# EAGLE design Ing_DC2013 (EAGLE 6.4)
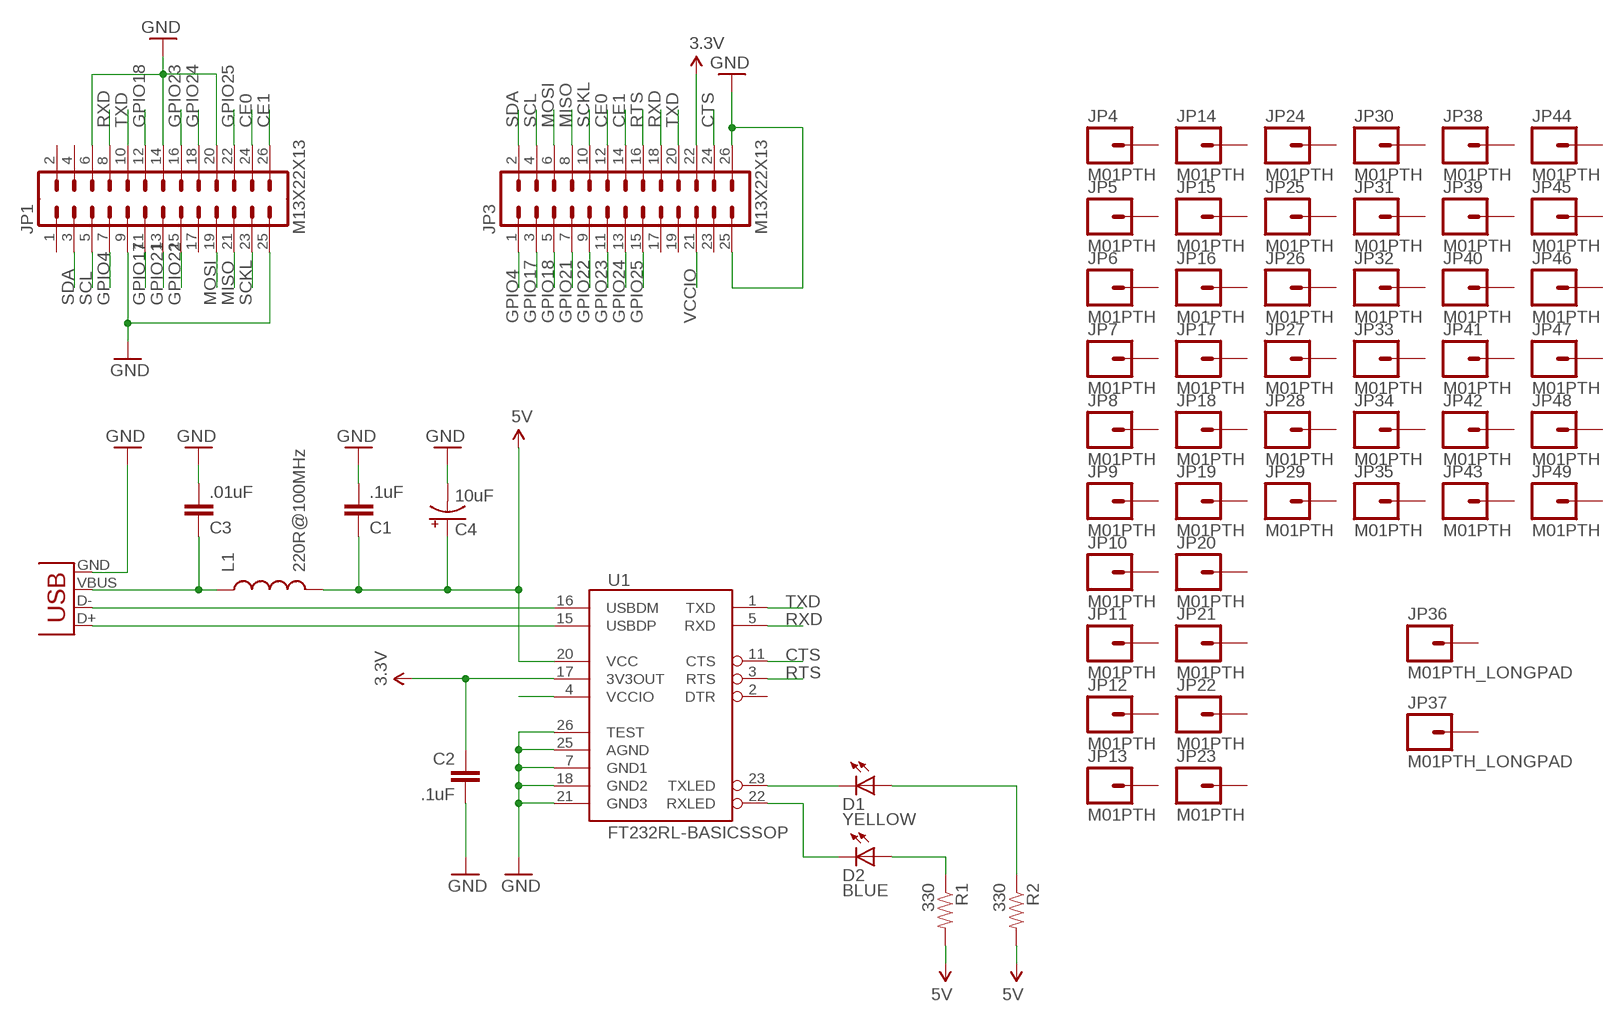
[diagram p0: schematic, sheet 1]

## Parts
C1  .1uF  CAP1206  [1206]
C2  .1uF  CAP1206  [1206]
C3  .01uF  CAP1206  [1206]
C4  10uF  CAP_POL1206  [EIA3216]
D1  YELLOW  LED-RED1206  [LED-1206]
D2  BLUE  LED-GREENLARGE  [LED-1206]
JP1  M13X22X13  [2X13]
JP2  USB-SMD-NS  [USB-MINIB-NOSTOP]
JP3  M13X22X13  [2X13]
JP4  M01PTH  [1X01]
JP5  M01PTH  [1X01]
JP6  M01PTH  [1X01]
JP7  M01PTH  [1X01]
JP8  M01PTH  [1X01]
JP9  M01PTH  [1X01]
JP10  M01PTH  [1X01]
JP11  M01PTH  [1X01]
JP12  M01PTH  [1X01]
JP13  M01PTH  [1X01]
JP14  M01PTH  [1X01]
JP15  M01PTH  [1X01]
JP16  M01PTH  [1X01]
JP17  M01PTH  [1X01]
JP18  M01PTH  [1X01]
JP19  M01PTH  [1X01]
JP20  M01PTH  [1X01]
JP21  M01PTH  [1X01]
JP22  M01PTH  [1X01]
JP23  M01PTH  [1X01]
JP24  M01PTH  [1X01]
JP25  M01PTH  [1X01]
JP26  M01PTH  [1X01]
JP27  M01PTH  [1X01]
JP28  M01PTH  [1X01]
JP29  M01PTH  [1X01]
JP30  M01PTH  [1X01]
JP31  M01PTH  [1X01]
JP32  M01PTH  [1X01]
JP33  M01PTH  [1X01]
JP34  M01PTH  [1X01]
JP35  M01PTH  [1X01]
JP36  M01PTH_LONGPAD  [1X01_LONGPAD]
JP37  M01PTH_LONGPAD  [1X01_LONGPAD]
JP38  M01PTH  [1X01]
JP39  M01PTH  [1X01]
JP40  M01PTH  [1X01]
JP41  M01PTH  [1X01]
JP42  M01PTH  [1X01]
JP43  M01PTH  [1X01]
JP44  M01PTH  [1X01]
JP45  M01PTH  [1X01]
JP46  M01PTH  [1X01]
JP47  M01PTH  [1X01]
JP48  M01PTH  [1X01]
JP49  M01PTH  [1X01]
L1  220R@100MHz  INDUCTOR1210  [1210]
R1  330  RESISTOR1206  [1206]
R2  330  RESISTOR1206  [1206]
U1  FT232RL-BASICSSOP  [SSOP28DB]

## Nets
3.3V: C2.1 JP3.22 U1.17(3V3OUT)
5V: C1.1 C4.A(+) L1.2 R1.2 R2.2 U1.20(VCC)
CE0: JP1.24 JP3.12
CE1: JP1.26 JP3.14
CTS: JP3.24 U1.11(CTS)
GND: C1.2 C2.2 C3.2 C4.C(-) JP1.6 JP1.9 JP1.14 JP1.20 JP1.25 JP2.GND JP3.25 JP3.26 U1.7(GND1) U1.18(GND2) U1.21(GND3) U1.25(AGND) U1.26(TEST)
GPIO4: JP1.7 JP3.1
GPIO17: JP1.11 JP3.3
GPIO18: JP1.12 JP3.5
GPIO21: JP1.13 JP3.7
GPIO22: JP1.15 JP3.9
GPIO23: JP1.16 JP3.11
GPIO24: JP1.18 JP3.13
GPIO25: JP1.22 JP3.15
MISO: JP1.21 JP3.8
MOSI: JP1.19 JP3.6
N$1: C3.1 JP2.VBUS L1.1
N$2: D2.A R1.1
N$3: D2.C U1.22(RXLED)
N$4: D1.C U1.23(TXLED)
N$5: JP2.D- U1.16(USBDM)
N$6: JP2.D+ U1.15(USBDP)
N$7: D1.A R2.1
RTS: JP3.16 U1.3(RTS)
RXD: JP1.8 JP3.18 U1.5(RXD)
SCKL: JP1.23 JP3.10
SCL: JP1.5 JP3.4
SDA: JP1.3 JP3.2
TXD: JP1.10 JP3.20 U1.1(TXD)
VCCIO: JP3.21 U1.4(VCCIO)
Unconnected: JP1.1 JP1.2 JP1.4 JP1.17 JP3.17 JP3.19 JP3.23 JP4.1 JP5.1 JP6.1 JP7.1 JP8.1 JP9.1 JP10.1 JP11.1 JP12.1 JP13.1 JP14.1 JP15.1 JP16.1 JP17.1 JP18.1 JP19.1 JP20.1 JP21.1 JP22.1 JP23.1 JP24.1 JP25.1 JP26.1 JP27.1 JP28.1 JP29.1 JP30.1 JP31.1 JP32.1 JP33.1 JP34.1 JP35.1 JP36.1 JP37.1 JP38.1 JP39.1 JP40.1 JP41.1 JP42.1 JP43.1 JP44.1 JP45.1 JP46.1 JP47.1 JP48.1 JP49.1 U1.2(DTR)

## Library data of the parts
C1-C3 = SparkFun-Capacitors:CAP: Capacitor Standard 0603 ceramic capacitor, and 0.1" leaded capacitor.
C4 = SparkFun-Capacitors:CAP_POL: Capacitor Polarized These are standard SMD and PTH capacitors. Normally 10uF, 47uF, and 100uF in electrolytic and tantalum varieties. Always verify the external diameter of the through hole cap, it varies with capacity, voltage, and manufacturer. The EIA devices should be standard.
D1 = SparkFun-LED:LED-RED: Assorted Red LEDs LilyPad 1206- DIO-09912 1206- DIO-00809 0603- DIO-00819; PROD_ID: DIO-00809; VALUE: RED
D2 = SparkFun-LED:LED-GREEN: Various green LEDs 0603- DIO-00821 LARGE- DIO-00862 LILYPAD- DIO-09910; PROD_ID: DIO-00862; VALUE: GREEN
JP1 JP3 = SparkFun-Connectors:M13X2: 0.1" spaced headers
JP2 = SparkFun-Connectors:USB: USB Connectors USB-B-PTH is fully proven SKU : PRT-00139/CONN-08278 USB-miniB is fully proven SKU : PRT-00587 USB-A-PCB is untested. USB-A-H is throughly reviewed, but untested. Spark Fun Electronics SKU : PRT-00437 USB-B-SMT is throughly reviewed, but untested. Needs silkscreen touching up. USB-A-S has not been used/tested USB-MB-H has not been used/tested USB-MICROB has been used. CONN-09505
JP4-JP49 = SparkFun-Connectors:M01: Header 1 Standard 1-pin 0.1" header. Use with straight break away headers (SKU : PRT-00116), right angle break away headers (PRT-00553), swiss pins (PRT-00743), machine pins (PRT-00117), and female headers (PRT-00115).
L1 = SparkFun-Passives:INDUCTOR: Inductors Basic Inductor/Choke - 0603 and 1206. Footprints are not proven and vary greatly between part numbers.
R1 R2 = SparkFun-Resistors:RESISTOR: Resistor Basic schematic elements and footprints for 0603, 1206, and PTH resistors.
U1 = SparkFun-DigitalIC:FT232RL-BASIC: USB UART This is the simplified version of the FT232RL unit. Only what you need, nothing you don't. Spark Fun Electronics SKU : COM-00650

## Net classes
0 default: width 0.305 mm, drill 0.508 mm, clearance 0.254 mm

## Board
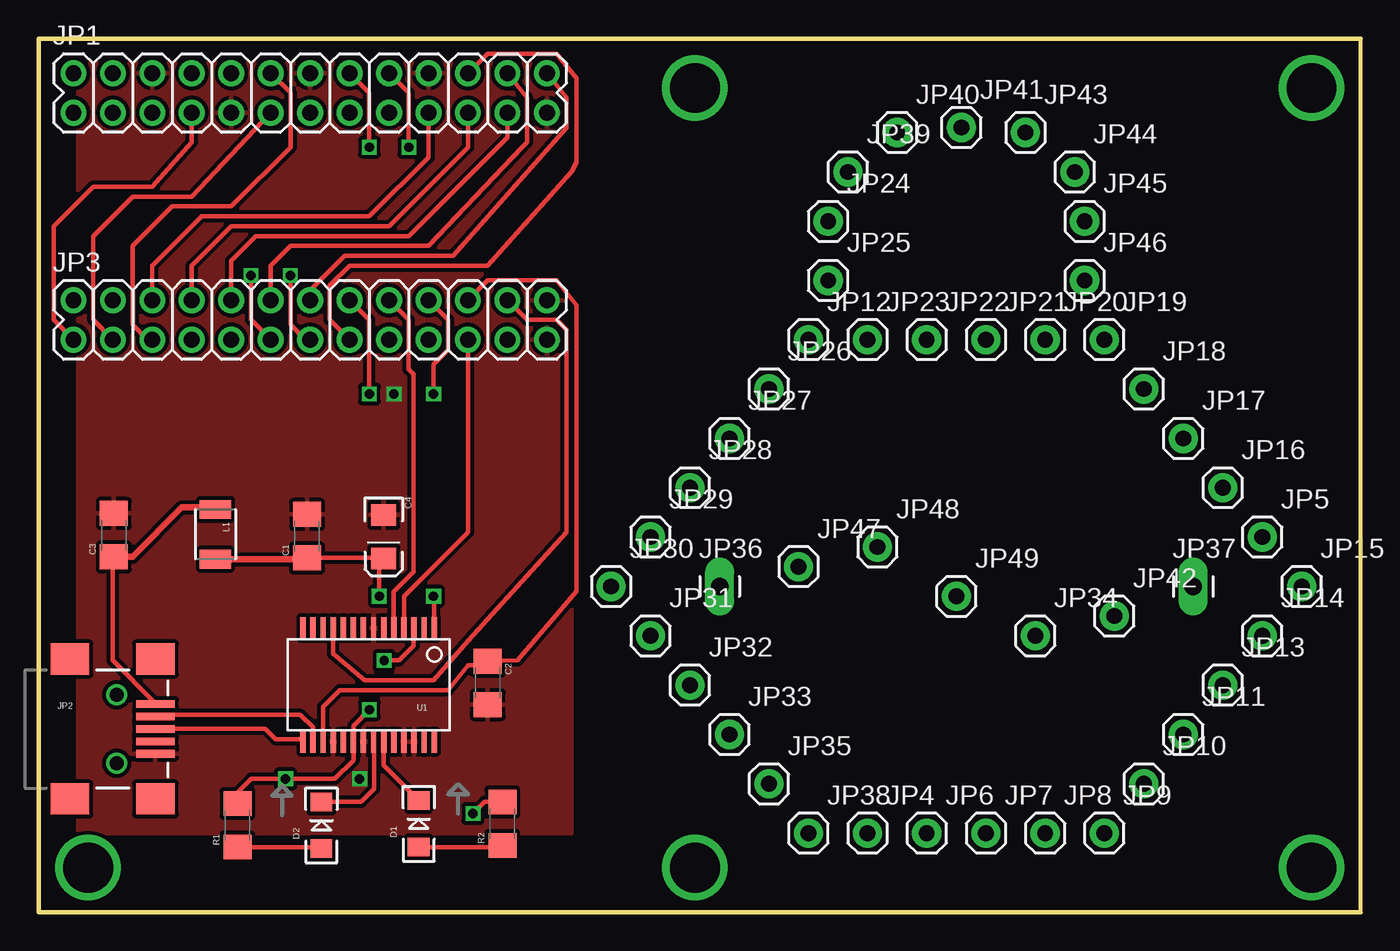
[diagram p1: board, top side]
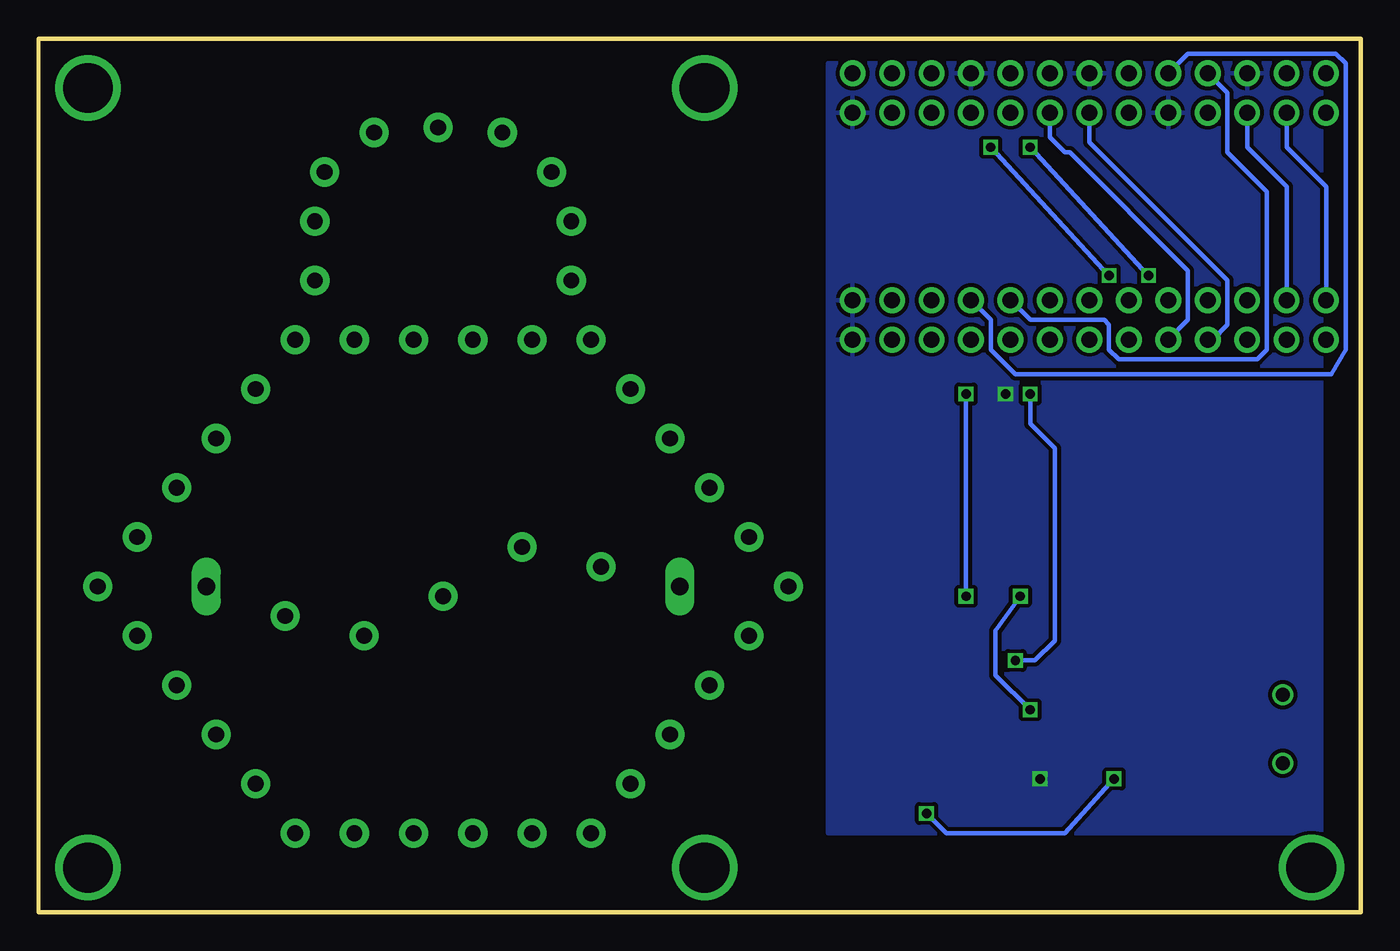
[diagram p2: board, bottom side, seen from below]

Size 85.08 x 56.19 mm. Coordinates in mm from the lower left corner, seen from the top.
Outline: 0,0 85.08,0 85.08,56.19 0,56.19 0,0
Copper layers (1*16): Top 0.0356mm / dielectric 1.5011mm / Bottom 0.0356mm
Design rules "LaenPCBOrder": minimum track width 6mil, minimum drill 13mil, track to track 6mil, track to pad 6mil, pad to pad 6mil, via to via 6mil, smd to smd 6mil, copper to edge 15mil, drill to drill 6mil, minimum pad ring 7mil, minimum via ring 7mil, stop-mask expansion 4mil, vias tented up to drill 0mil, thermal gap 10mil

### Footprints (pad centres in the part's own frame; a part is rotated, then mirrored left to right if it is on the bottom)
1206 = smd 1.6 x 1.8: 1 -1.4,0; 2 1.4,0
EIA3216 = smd 1.4 x 1.6: A 1.4,0; C -1.4,0
LED-1206 = smd 1.2 x 1.4: A -1.5,0; C 1.5,0
2X13 = drill 1.016 pad 1.651: 1 0,0; 2 0,2.54; 3 2.54,0; 4 2.54,2.54; 5 5.08,0; 6 5.08,2.54; 7 7.62,0; 8 7.62,2.54; 9 10.16,0; 10 10.16,2.54; 11 12.7,0; 12 12.7,2.54; 13 15.24,0; 14 15.24,2.54; 15 17.78,0; 16 17.78,2.54; 17 20.32,0; 18 20.32,2.54; 19 22.86,0; 20 22.86,2.54; 21 25.4,0; 22 25.4,2.54; 23 27.94,0; 24 27.94,2.54; 25 30.48,0; 26 30.48,2.54
USB-MINIB-NOSTOP = smd 2.5 x 0.5: D+ 2.5,0; D- 2.5,0.8; GND 2.5,-1.6; ID 2.5,-0.8; VBUS 2.5,1.6 | smd 2.5 x 2: G1 -3,-4.5; G2 -3,4.5; G3 2.5,4.5; G4 2.5,-4.5 | drill 0.9 pad 0.8: H1 0,2.2 | drill 0.9 pad 0.787: H2 0,-2.2
1X01 = drill 1.016 pad 1.88: 1 0,0
1X01_LONGPAD = drill 1.118 pad 1.88 long: 1 0,0
1210 = smd 1.2 x 2: 1 -1.6,0; 2 1.6,0
SSOP28DB = smd 0.348 x 1.397: 1 -4.225,-3.656; 2 -3.575,-3.656; 3 -2.925,-3.656; 4 -2.275,-3.656; 5 -1.625,-3.656; 6 -0.975,-3.656; 7 -0.325,-3.656; 8 0.325,-3.656; 9 0.975,-3.656; 10 1.625,-3.656; 11 2.275,-3.656; 12 2.925,-3.656; 13 3.575,-3.656; 14 4.225,-3.656; 15 4.225,3.656; 16 3.575,3.656; 17 2.925,3.656; 18 2.275,3.656; 19 1.625,3.656; 20 0.975,3.656; 21 0.325,3.656; 22 -0.325,3.656; 23 -0.975,3.656; 24 -1.625,3.656; 25 -2.275,3.656; 26 -2.925,3.656; 27 -3.575,3.656; 28 -4.225,3.656

### Placement (x,y rotation side)
C1  17.26,24.19 90 top
C2  28.89,14.74 270 top
C3  4.83,24.26 90 top
C4  22.2,24.16 270 top
D1  24.45,5.69 90 top
D2  18.19,5.59 90 top
JP1  2.22,51.44 0 top
JP2  5,11.79 0 top
JP3  2.22,36.83 0 top
JP4  53.34,5.08 0 top
JP5  78.74,24.13 0 top
JP6  57.15,5.08 0 top
JP7  60.96,5.08 0 top
JP8  64.77,5.08 0 top
JP9  68.58,5.08 0 top
JP10  71.12,8.26 0 top
JP11  73.66,11.43 0 top
JP12  49.53,36.83 0 top
JP13  76.2,14.61 0 top
JP14  78.74,17.78 0 top
JP15  81.28,20.95 0 top
JP16  76.2,27.3 0 top
JP17  73.66,30.48 0 top
JP18  71.12,33.66 0 top
JP19  68.58,36.83 0 top
JP20  64.77,36.83 0 top
JP21  60.96,36.83 0 top
JP22  57.15,36.83 0 top
JP23  53.34,36.83 0 top
JP24  50.8,44.45 0 top
JP25  50.8,40.64 0 top
JP26  46.99,33.66 0 top
JP27  44.45,30.48 0 top
JP28  41.91,27.3 0 top
JP29  39.37,24.13 0 top
JP30  36.83,20.95 0 top
JP31  39.37,17.78 0 top
JP32  41.91,14.61 0 top
JP33  44.45,11.43 0 top
JP34  64.14,17.78 0 top
JP35  46.99,8.26 0 top
JP36  43.81,20.95 0 top
JP37  74.3,20.95 0 top
JP38  49.53,5.08 0 top
JP39  52.07,47.62 0 top
JP40  55.24,50.16 0 top
JP41  59.37,50.48 0 top
JP42  69.22,19.05 0 top
JP43  63.5,50.16 0 top
JP44  66.67,47.62 0 top
JP45  67.31,44.45 0 top
JP46  67.31,40.64 0 top
JP47  48.9,22.23 0 top
JP48  53.98,23.5 0 top
JP49  59.05,20.32 0 top
L1  11.37,24.31 270 top
R1  12.79,5.59 90 top
R2  29.84,5.69 90 top
U1  21.22,14.62 180 top

### Tracks (layer width: path | path; a pad name or v marks a point on that pad's centre or on a via)
3.3V
  Top 0.305: U1.17 18.3,13.22 19.37,14.29 26.35,14.29 27.62,15.88 28.62,15.88 C2.1 30.8,16.19 34.61,20.64 34.61,39.05 33.34,40.64 28.89,40.64 JP3.22
5V  (via drill 0.6)
  Top 0.305: C1.1 17.78,22.79 22.16,22.79 C4.A 21.91,22.46 v21.91,20.32 | v21.27,13.02 20.25,11.99 U1.20 20.25,9.77 19.05,8.57 v15.88,8.57 13.65,8.57 12.79,7.71 R1.2 | R2.2 28.68,7.09 v27.94,6.35
  Top 0.406: L1.2 17.69,22.71 17.78,22.79
  Bottom 0.305: v21.27,13.02 23.5,15.24 23.5,18.1 v21.91,20.32 | v15.88,8.57 19.05,5.08 26.67,5.08 v27.94,6.35
CE0
  Top 0.305: JP3.12 14.92,41.59 16.19,42.86 25.08,42.86 31.11,49.21 31.43,49.53 31.43,52.39 JP1.24
CE1
  Top 0.305: JP3.14 17.46,40.01 19.68,42.23 26.67,42.23 33.97,50.48 33.97,52.39 JP1.26
CTS
  Top 0.305: JP3.24 31.43,38.1 33.34,38.1 33.97,37.47 33.97,24.45 27.62,17.46 25.4,14.92 20.95,14.92 18.95,16.61 U1.11
GND  (via drill 0.6)
  other vias: 22.86,33.34 20.64,8.57
  pour Bottom: 2.54,54.61 2.54,5.08 34.29,5.08 34.29,54.61
  pour Top: 34.29,5.08 34.29,54.61 2.54,54.61 2.54,5.08
GPIO4
  Top 0.305: JP3.1 0.95,38.1 0.95,44.13 3.49,46.67 7.3,46.67 9.84,49.53 JP1.7
GPIO17
  Top 0.305: JP3.3 3.49,38.1 3.49,43.5 6.03,46.04 9.84,46.04 JP1.11
GPIO18
  Top 0.305: JP3.5 6.99,36.83 6.03,37.78 6.03,42.86 8.57,45.4 12.38,45.4 16.19,49.21 16.19,52.7 JP1.12
GPIO21
  Bottom 0.305: JP3.7 9.53,36.83 8.57,37.78 8.57,40.64 17.46,49.53 JP1.13
GPIO22
  Bottom 0.305: JP1.15 20,49.85 19.05,48.9 18.73,48.9 11.11,41.27 11.11,38.1 JP3.9
GPIO23  (via drill 0.6)
  Top 0.305: JP3.11 13.65,38.1 v13.65,40.96 | v21.27,49.21 21.27,52.7 JP1.16
  Bottom 0.305: v13.65,40.96 v21.27,49.21
GPIO24  (via drill 0.6)
  Top 0.305: JP3.13 17.14,36.83 16.19,37.78 v16.19,40.96 | v23.81,49.21 23.81,52.7 JP1.18
  Bottom 0.305: v16.19,40.96 v23.81,49.21
GPIO25
  Top 0.305: JP3.15 18.73,38.1 18.73,40.32 20,41.59 28.89,41.59 34.29,47.62 34.61,48.26 34.61,53.66 33.34,55.24 28.89,55.24 JP1.22
MISO
  Top 0.305: JP3.8 9.84,41.59 12.38,44.13 22.54,44.13 27.62,49.21 JP1.21
MOSI
  Top 0.305: JP3.6 7.3,41.59 10.48,44.77 21.27,44.77 25.08,48.58 JP1.19
N$1
  Top 0.305: JP2.VBUS 7.5,13.45 4.76,16.19 4.76,22.79 C3.1
  Top 0.406: C3.1 6.03,22.86 9.21,26.04 11.24,26.04 L1.1
N$2
  Top 0.305: R1.1 18.09,4.19 D2.A
N$3
  Top 0.305: D2.C 20.74,7.09 21.59,7.94 21.59,10.92 U1.22
N$4
  Top 0.305: U1.23 22.2,9.44 D1.C
N$5
  Top 0.305: U1.16 17.65,11.88 16.83,12.7 7.62,12.7 JP2.D-
N$6
  Top 0.305: JP2.D+ 14.57,11.79 15.24,11.11 16.85,11.11 U1.15
N$7
  Top 0.305: D1.A 29.75,4.19 R2.1
N$8  (via drill 3.2)
  other vias: 42.23,53.02
N$9  (via drill 3.2)
  other vias: 81.92,53.02
N$10  (via drill 3.2)
  other vias: 81.92,2.86
N$11  (via drill 3.2)
  other vias: 42.23,2.86
N$12  (via drill 3.2)
  other vias: 3.17,2.86
RTS  (via drill 0.6)
  Top 0.305: JP3.16 21.27,38.1 v21.27,33.34 | v22.23,16.19 23.18,16.19 24.13,17.14 24.13,18.26 U1.3
  Bottom 0.305: v21.27,33.34 21.27,31.43 19.68,29.84 19.68,17.46 20.95,16.19 v22.23,16.19
RXD
  Top 0.305: U1.5 22.85,20.62 24.13,21.91 24.13,34.61 23.81,34.92 23.81,38.1 JP3.18
  Bottom 0.305: JP3.18 21.27,38.1 16.51,38.1 16.19,37.78 16.19,36.2 15.56,35.56 6.67,35.56 6.03,36.2 6.03,46.35 8.57,48.9 8.57,52.7 JP1.8
SCKL
  Top 0.305: JP3.10 12.38,41.91 13.97,43.5 23.81,43.5 30.16,49.85 JP1.23
SCL
  Bottom 0.305: JP3.4 4.76,46.67 7.3,49.21 JP1.5
SDA
  Bottom 0.305: JP3.2 2.22,46.67 4.76,49.21 JP1.3
TXD  (via drill 0.6)
  Top 0.305: U1.1 25.45,20.27 v25.4,20.32 | v25.4,33.34 25.4,35.24 26.35,36.2 26.35,38.1 JP3.20
  Bottom 0.305: JP1.10 11.11,55.24 1.59,55.24 0.95,54.61 0.95,36.2 1.91,34.61 22.23,34.61 23.81,36.2 23.81,38.1 JP3.20 | v25.4,20.32 v25.4,33.34
VCCIO
  Top 0.305: U1.4 23.5,20.32 27.62,24.45 JP3.21

### Text on the board
tDocu: InGuardians, Inc. | Since 2003 | 26 Pin Raspberry Pi Connector | SDA | SCL | MOSI | MISO | SCKL | CE0 | CE1 | RTS | RXD | TXD | 3.3V | CTS | GND | GPIO4 | GPIO17 | GPIO18 | GPIO21 | GPIO22 | GPIO23 | GPIO24 | GPIO25 | 5V | GND | Sparring Board v1.2 / Raspberry Pi Edition | Jay Radcliffe / @jradcliffe02 | 10uF | security@inguardians.com | 0.01uF | 0.1uF | FERRITE | USB Mini | FTDI RS232RL | 0.1uF | Don C. Weber / @cutaway | 2013 | LED | LED | 330 | RX | TX | 330 | http://labs.inguardians.com
bDocu: InGuardians, Inc. | Vendor Provided, / InGuardians Pwned! | This is an InGuardians Sparring Board. / It is designed to integrate with a / Raspberry Pi and other things. | John Sawyer / @johnhsawyer | It has the same basic rules as / other embedded devices, rules / like electricity. | Chris Sanders / @chrissanders88 | Tom Liston / @tliston | What you must learn is that / these rules are no different / than the rules of a computer / system... | Mike Poor / @mike_poor | ...some of them can be bent. / Others...can be broken. | Jimmy Alderson / @jimmyZATL | Jay Beale / @jaybeale | Understand? | Fabricated in USA